# EAGLE design science_task (EAGLE 7.5.0)
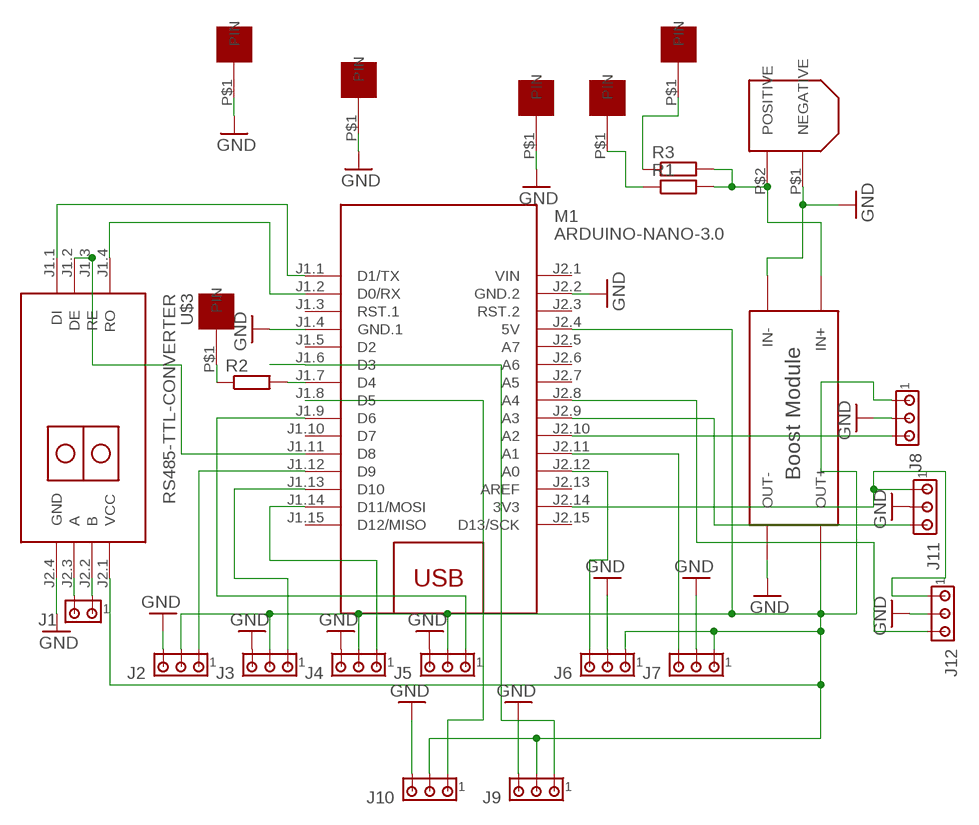
[diagram p0: schematic, sheet 1]

## Parts
J1  MTA02-100  [10X02MTA]
J2  MTA03-100  [10X03MTA]
J3  MTA03-100  [10X03MTA]
J4  MTA03-100  [10X03MTA]
J5  MTA03-100  [10X03MTA]
J6  MTA03-100  [10X03MTA]
J7  MTA03-100  [10X03MTA]
J8  MTA03-100  [10X03MTA]
J9  MTA03-100  [10X03MTA]
J10  MTA03-100  [10X03MTA]
J11  MTA03-100  [10X03MTA]
J12  MTA03-100  [10X03MTA]
M1  ARDUINO-NANO-3.0  [ARDUINO-NANO-3.0]
R1  R-EU_0204/7  [0204/7]
R2  R-EU_0204/7  [0204/7]
R3  R-EU_0204/7  [0204/7]
U$1  XT60  [CONNECTOR]
U$2  BOOST_MODULE  [BOOST_MODULE]
U$3  RS485-TTL-CONVERTER  [RS485-TTL-CONVERTER]
U$4  VIA  [VIA]
U$5  VIA  [VIA]
U$6  VIA  [VIA]
U$7  VIA  [VIA]
U$8  VIA  [VIA]
U$9  VIA  [VIA]

## Nets
GND: J2.3 J3.3 J4.3 J5.3 J6.2 J7.2 J8.2 J9.3 J10.3 J11.2 J12.2 M1.J1.4(GND.1) M1.J2.2(GND.2) U$1.P$1(NEGATIVE) U$2.IN- U$2.OUT- U$3.J2.4(GND) U$5.P$1(PIN) U$7.P$1(PIN) U$9.P$1(PIN)
N$1: R1.2 R3.2 U$1.P$2(POSITIVE) U$2.IN+
N$2: J2.2 J3.2 J4.2 J5.2 J6.1 J7.1 J8.1 J9.2 J10.2 M1.J2.4(5V) U$2.OUT+ U$3.J2.1(VCC)
N$3: J2.1 M1.J1.12(D9)
N$4: J11.3 M1.J2.9(A3)
N$5: J3.1 M1.J1.13(D10)
N$6: J1.2 U$3.J2.3(A)
N$7: J1.1 U$3.J2.2(B)
N$8: M1.J1.2(D0/RX) U$3.J1.4(RO)
N$9: M1.J1.1(D1/TX) U$3.J1.1(DI)
N$10: M1.J1.11(D8) U$3.J1.2(DE) U$3.J1.3(RE)
N$11: J4.1 M1.J1.14(D11/MOSI)
N$12: J5.1 M1.J1.9(D6)
N$13: J6.3 M1.J2.12(A0)
N$14: J7.3 M1.J2.11(A1)
N$15: J8.3 M1.J2.10(A2)
N$16: J10.1 M1.J1.8(D5)
N$17: J9.1 M1.J1.6(D3)
N$18: J12.3 M1.J2.8(A4)
N$19: J11.1 J12.1 M1.J2.14(3V3)
N$20: M1.J1.7(D4) R2.2
N$21: R1.1 U$4.P$1(PIN)
N$22: R2.1 U$6.P$1(PIN)
N$23: R3.1 U$8.P$1(PIN)
Unconnected: M1.J1.3(RST.1) M1.J1.5(D2) M1.J1.10(D7) M1.J1.15(D12/MISO) M1.J2.3(RST.2) M1.J2.5(A7) M1.J2.6(A6) M1.J2.7(A5) M1.J2.13(AREF) M1.J2.15(D13/SCK)

## Power pins joined to a net without a drawn wire
VIN: M1.J2.1(VIN)

## Library data of the parts
J1 = con-amp:MTA02-100: AMP connector
J2-J12 = con-amp:MTA03-100: AMP connector
M1 = diy-modules:ARDUINO-NANO-3.0: Arduino Nano 3.0 and compatible devices More details available here: https://www.arduino.cc/en/Main/ArduinoBoardNano Click here to find device on ebay.com <http://www.ebay.com/sch/arduino+nano>
R1-R3 = rcl:R-EU_: RESISTOR, European symbol
U$1 = xt60_V2:XT60
U$2 = Boost Module:BOOST_MODULE
U$3 = diy-modules:RS485-TTL-CONVERTER: RS485 to TTL converter based on MAX485 chip
U$4-U$9 = via:VIA

## Board
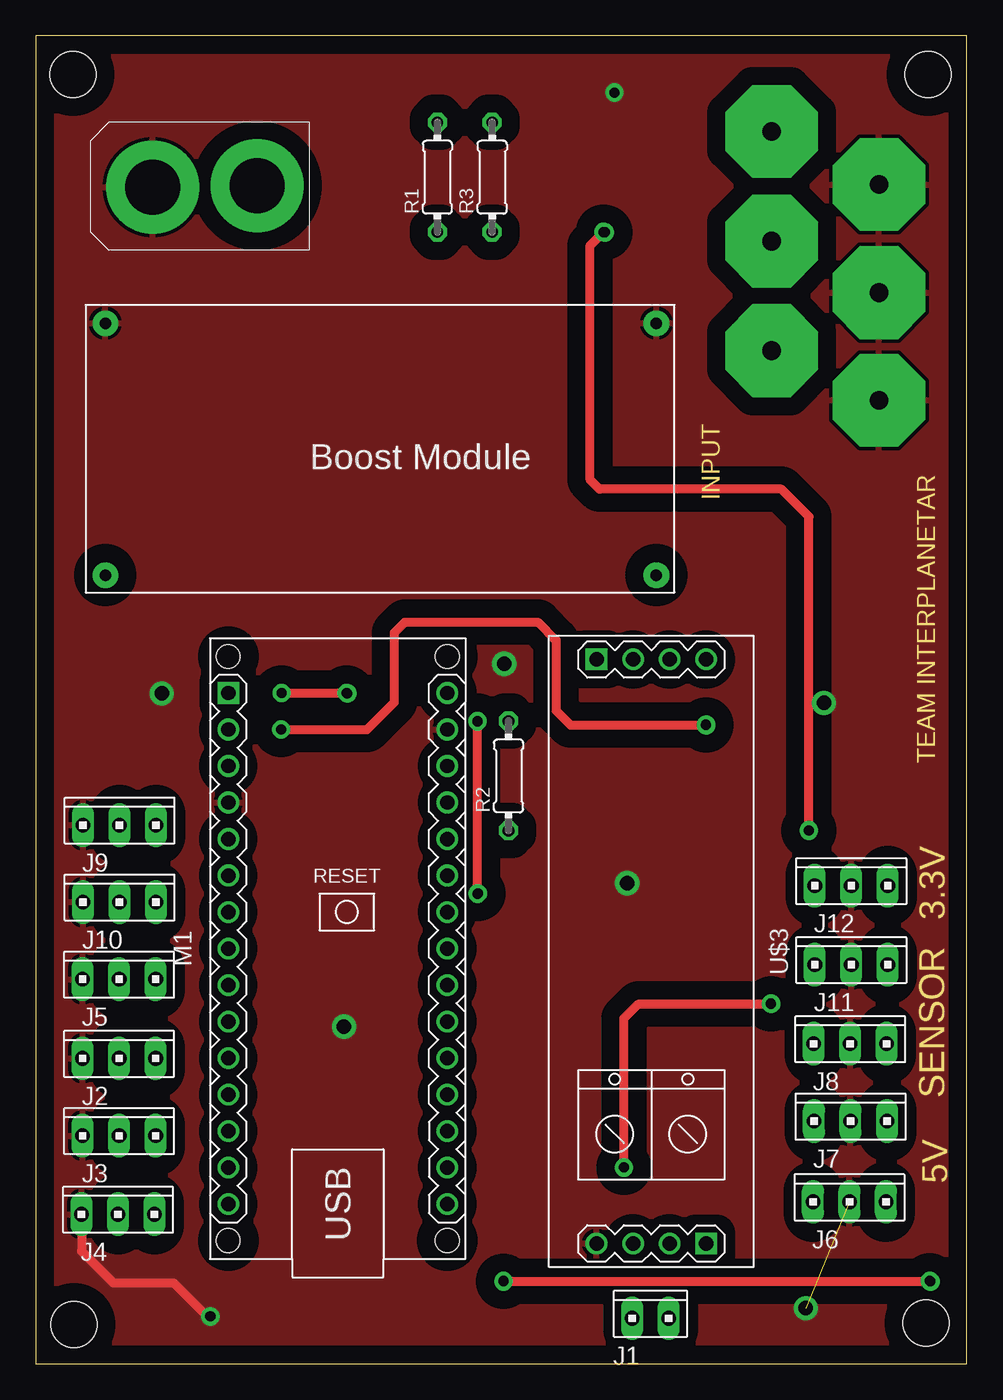
[diagram p1: board, top side]
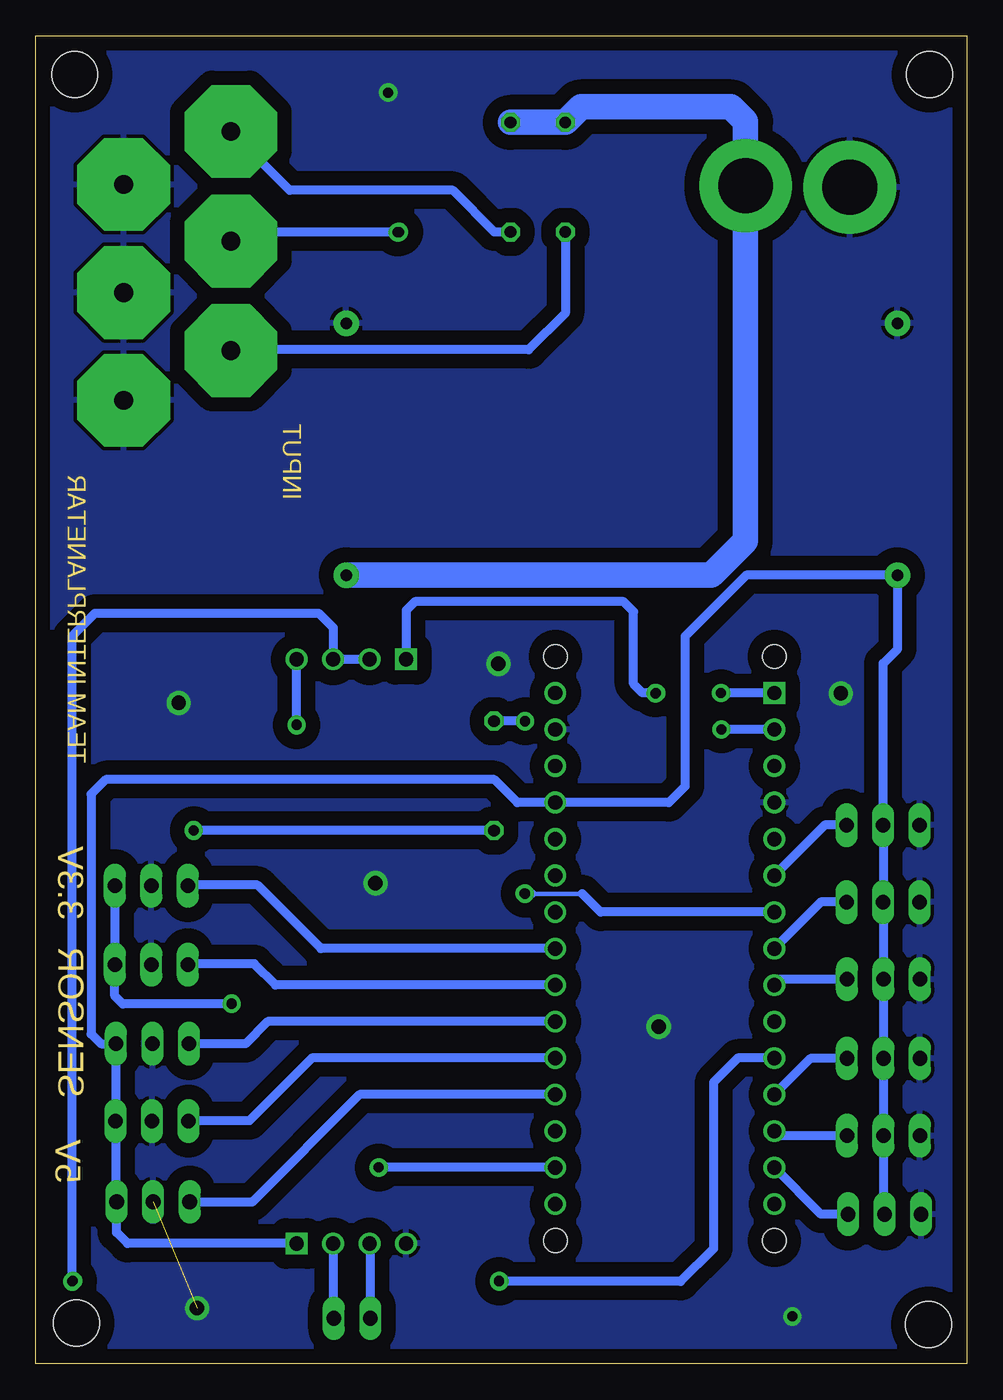
[diagram p2: board, bottom side, seen from below]

Size 64.78 x 92.38 mm. Coordinates in mm from the lower left corner, seen from the top.
Outline: 0,0 64.78,0 64.78,92.38 0,92.38 0,0
Copper layers (1*16): Top 0.035mm / dielectric 1.5mm / Bottom 0.035mm
Design rules "default": minimum track width 10mil, minimum drill 24mil, track to track 8mil, track to pad 8mil, pad to pad 8mil, via to via 8mil, smd to smd 8mil, copper to edge 40mil, drill to drill 8mil, minimum pad ring 10mil, minimum via ring 8mil, stop-mask expansion 4mil, vias tented up to drill 0mil, thermal gap 10mil
Holes 3.2 mm at 2.59,89.69 62.08,89.69 61.95,2.82 2.64,2.72

### Footprints (pad centres in the part's own frame; a part is rotated, then mirrored left to right if it is on the bottom)
10X02MTA = drill 1.016 long: 1 1.27,0; 2 -1.27,0
10X03MTA = drill 1.016 long: 1 2.54,0; 2 0,0; 3 -2.54,0
ARDUINO-NANO-3.0 = drill 1 square: J1.1 17.78,7.62 | drill 1: J1.2 15.24,7.62; J1.3 12.7,7.62; J1.4 10.16,7.62; J1.5 7.62,7.62; J1.6 5.08,7.62; J1.7 2.54,7.62; J1.8 0,7.62; J1.9 -2.54,7.62; J1.10 -5.08,7.62; J1.11 -7.62,7.62; J1.12 -10.16,7.62; J1.13 -12.7,7.62; J1.14 -15.24,7.62; J1.15 -17.78,7.62; J2.1 17.78,-7.62; J2.2 15.24,-7.62; J2.3 12.7,-7.62; J2.4 10.16,-7.62; J2.5 7.62,-7.62; J2.6 5.08,-7.62; J2.7 2.54,-7.62; J2.8 0,-7.62; J2.9 -2.54,-7.62; J2.10 -5.08,-7.62; J2.11 -7.62,-7.62; J2.12 -10.16,-7.62; J2.13 -12.7,-7.62; J2.14 -15.24,-7.62; J2.15 -17.78,-7.62 | hole 1.651: -20.32,7.62; -20.32,-7.62; 20.32,-7.62; 20.32,7.62
0204/7 = drill 0.813 octagon: 1 -3.81,0; 2 3.81,0
CONNECTOR = drill 3.81 pad 6.452: P$1 4.394,12.192; P$2 4.496,4.928
BOOST_MODULE = drill 0.8 pad 1.778: IN+ 1.27,18.796; IN- 1.27,1.27; OUT+ 39.624,18.796; OUT- 39.624,1.27
RS485-TTL-CONVERTER = drill 1 square: J1.1 -20.32,-3.81; J2.1 20.32,3.81 | drill 1: J1.2 -20.32,-1.27; J1.3 -20.32,1.27; J1.4 -20.32,3.81; J2.2 20.32,1.27; J2.3 20.32,-1.27; J2.4 20.32,-3.81
VIA = drill 1.3 pad 6.452 octagon: P$1 1.905,3.404

### Placement (x,y rotation side)
J1  42.77,3.15 0 top
J2  5.79,21.23 0 top
J3  5.79,15.85 0 top
J4  5.71,10.39 0 top
J5  5.79,26.75 0 top
J6  56.62,11.25 0 top
J7  56.69,16.87 0 top
J8  56.67,22.25 0 top
J9  5.82,37.46 0 top
J10  5.82,32.11 0 top
J11  56.74,27.76 0 top
J12  56.74,33.25 0 top
M1  21.01,28.88 90 top
R1  27.94,82.55 90 top
R2  32.89,40.89 90 top
R3  31.75,82.55 90 top
U$1  20.32,77.47 90 top
U$2  44.45,73.66 180 top
U$3  42.82,28.68 270 top
U$4  54.61,68.58 90 top
U$5  62.08,65.13 90 top
U$6  54.61,76.2 90 top
U$7  62.08,72.62 90 top
U$8  54.61,83.82 90 top
U$9  62.08,80.14 90 top

### Tracks (layer width: path | path; a pad name or v marks a point on that pad's centre or on a via)
GND  (via drill 0.7 pad 1.27, 1 pad 1.68)  (1 unrouted)
  Top 0.61: J4.3 3.17,7.82 5.38,5.61 9.58,5.61 11.91,3.28 12.06,3.28 12.14,3.2
  other vias: 40.26,88.44 12.14,3.28 21.44,23.44 54.84,45.97 53.57,3.86 8.76,46.63 32.59,48.69 41.15,33.43
  pour Top (isolate 1.27): -1.27,95.25 69.85,95.25 69.85,-2.54 -1.27,-2.54
  pour Bottom (isolate 1.016): 0,93.98 68.58,93.98 68.58,-1.27 0,-1.27
N$1
  Bottom 1.778: R3.2 R1.2 26.85,87.45 16.41,87.45 15.39,86.44 U$1.P$2 15.42,81.94 15.42,57.23 17.78,54.86 U$2.IN+
N$2
  Bottom 0.61: J4.2 5.79,10.46 J3.2 J2.2 J5.2 5.82,26.77 J10.2 J9.2 5.82,48.72 4.8,49.73 4.8,54.84 U$2.OUT+ 15.34,54.86 19.61,50.6 19.61,40.16 20.73,39.04 M1.J2.4 31.27,39.04 32.87,40.64 59.92,40.64 60.94,39.62 60.94,22.94 60.25,22.25 J8.1 59.21,16.89 J7.1 59.23,11.33 J6.1 59.16,9.12 58.4,8.36 U$3.J2.1
N$3
  Bottom 0.61: J2.1 10.87,21.23 M1.J1.12
N$4
  Bottom 0.61: M1.J2.9 48.11,26.34 49.58,27.81 54.15,27.81 J11.3
N$5
  Bottom 0.61: J3.1 13.06,15.85 M1.J1.13
N$6
  Bottom 0.61: J1.2 41.5,8.31 U$3.J2.3
N$7
  Bottom 0.61: J1.1 44.04,8.31 U$3.J2.2
N$8  (via drill 0.7 pad 1.27)
  Top 0.61: v17.07,44.12 23.04,44.12 24.94,46.02 24.94,50.85 25.68,51.59 34.92,51.59 36.2,50.32 36.2,45.44 37.21,44.42 v46.63,44.42
  Bottom 0.61: M1.J1.2 v17.07,44.12 | v46.63,44.42 U$3.J1.4
N$9  (via drill 0.7 pad 1.27)
  Top 0.61: v17.09,46.66 v21.61,46.66
  Bottom 0.61: M1.J1.1 v17.09,46.66 | v21.61,46.66 22.55,46.66 23.19,47.29 23.19,52.32 23.88,53.01 38.41,53.01 39.01,52.4 U$3.J1.1
N$10  (via drill 0.7 pad 1.27)
  Top 0.61: v32.54,5.71 v62.26,5.71
  Bottom 0.61: U$3.J1.2 U$3.J1.3 44.09,51.21 45.11,52.22 60.66,52.22 62.26,50.62 v62.26,5.71 | M1.J1.11 15.93,21.26 17.63,19.56 17.63,8 19.91,5.71 v32.54,5.71
N$11
  Bottom 0.61: J4.1 10.13,10.39 M1.J1.14
N$12
  Bottom 0.61: J5.1 12.98,26.75 M1.J1.9
N$13
  Bottom 0.61: M1.J2.12 42.24,18.72 49.73,11.23 54.05,11.23 J6.3
N$14
  Bottom 0.61: M1.J2.11 45.57,21.26 49.94,16.89 54.13,16.89 J7.3
N$15
  Bottom 0.61: M1.J2.10 48.64,23.8 50.19,22.25 J8.3
N$16
  Bottom 0.61: J10.1 10.16,32.11 M1.J1.8
N$17
  Bottom 0.61: J9.1 9.88,37.46 M1.J1.6
N$18
  Bottom 0.61: M1.J2.8 44.93,28.88 49.35,33.3 54.15,33.3 J12.3
N$19  (via drill 0.7 pad 1.27)
  Top 0.61: v40.92,13.64 40.92,24 41.94,25.02 v51.16,25.02
  Bottom 0.61: J12.1 J11.1 59.28,25.58 58.73,25.02 v51.16,25.02 | M1.J2.14 v40.92,13.64
N$20  (via drill 0.7 pad 1.27)
  Top 0.61: v30.73,32.69 v30.73,44.68 v30.73,44.7
  Bottom 0.305: 26.75,32.69 30.28,32.69
  Bottom 0.61: M1.J1.7 25.48,31.42 26.75,32.69 | 30.28,32.69 v30.73,32.69 | v30.73,44.7 R2.2
N$21
  Bottom 0.61: R1.1 27.94,73.08 30.48,70.54 51.16,70.54 U$4.P$1
N$22  (via drill 0.7 pad 1.27)
  Top 0.61: v53.8,37.08 53.8,58.93 51.89,60.83 39.22,60.83 38.56,61.49 38.56,77.8 v39.5,78.74
  Bottom 0.61: R2.1 v53.8,37.08 | v39.5,78.74 50.57,78.74 U$6.P$1
N$23
  Bottom 0.61: R3.1 32.87,78.74 35.76,81.64 47.12,81.64 U$8.P$1
N$37  (via drill 0.7 pad 1.27)
  other vias: 21.67,46.63
N$38  (via drill 0.7 pad 1.27)
  other vias: 46.63,44.45
N$39  (via drill 0.7 pad 1.27)
  other vias: 32.54,5.74
N$40  (via drill 0.7 pad 1.27)
  other vias: 62.2,5.77
N$41  (via drill 0.7 pad 1.27)
  other vias: 51.16,25.04
N$42  (via drill 0.7 pad 1.27)
  other vias: 53.8,37.11
N$43  (via drill 0.7 pad 1.27)
  other vias: 39.6,78.71
N$45  (via drill 0.7 pad 1.27)
  other vias: 30.76,32.72

### Text on the board
Dimension: TEAM INTERPLANETAR | INPUT | 3.3V | SENSOR | 5V